# EAGLE design sofi_v7_main (EAGLE 9.1.0)

## Sheet 1 of 2
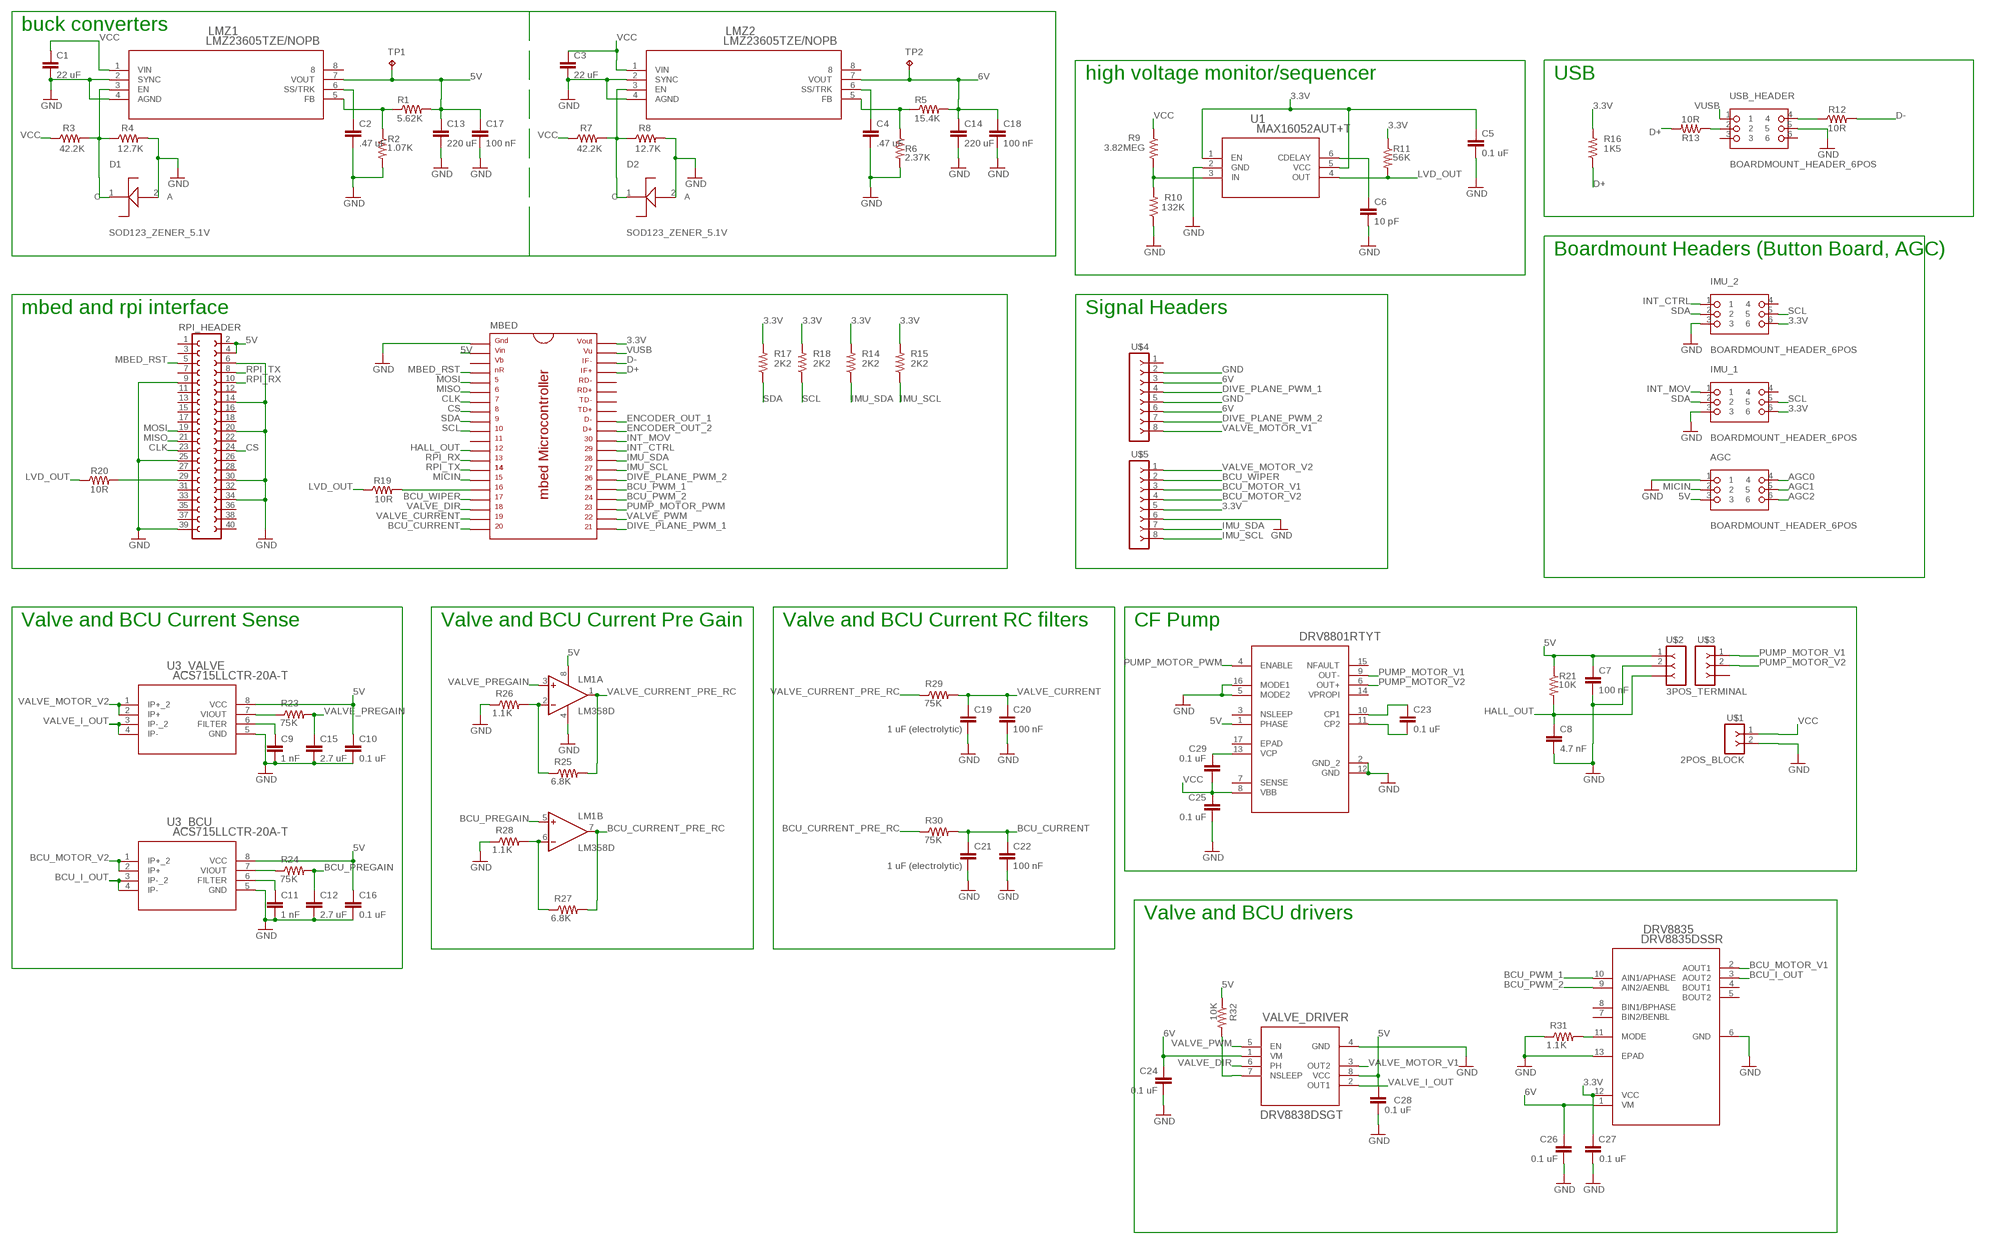
[diagram p0: schematic, sheet 1]

### Parts
AGC  BOARDMOUNT_HEADER_6POS  [BOARDMOUNT_HEADER]
C1  22 uF  C-EUC0805  [C0805]
C2  .47 uF  C-EUC0805  [C0805]
C3  22 uF  C-EUC0805  [C0805]
C4  .47 uF  C-EUC0805  [C0805]
C5  0.1 uF  C-EUC0805  [C0805]
C6  10 pF  C-EUC0603  [C0603]
C7  100 nF  C-EUC0805  [C0805]
C8  4.7 nF  C-EUC0805  [C0805]
C9  1 nF  C-EUC0603  [C0603]
C10  0.1 uF  C-EUC0603  [C0603]
C11  1 nF  C-EUC0603  [C0603]
C12  2.7 uF  C-EUC0603  [C0603]
C13  220 uF  C-EUC1206  [C1206]
C14  220 uF  C-EUC1206  [C1206]
C15  2.7 uF  C-EUC0603  [C0603]
C16  0.1 uF  C-EUC0603  [C0603]
C17  100 nF  C-EUC0805  [C0805]
C18  100 nF  C-EUC0805  [C0805]
C19  1 uF (electrolytic)  C-EUC0603  [C0603]
C20  100 nF  C-EUC0805  [C0805]
C21  1 uF (electrolytic)  C-EUC0603  [C0603]
C22  100 nF  C-EUC0805  [C0805]
C23  0.1 uF  C-EUC0805  [C0805]
C24  0.1 uF  C-EUC0603  [C0603]
C25  0.1 uF  C-EUC0603  [C0603]
C26  0.1 uF  C-EUC0603  [C0603]
C27  0.1 uF  C-EUC0603  [C0603]
C28  0.1 uF  C-EUC0603  [C0603]
C29  0.1 uF  C-EUC0805  [C0805]
D1  SOD123_ZENER_5.1V  [SOD123_ZENER]
D2  SOD123_ZENER_5.1V  [SOD123_ZENER]
DRV8801  DRV8801RTYT  [RTY16]
DRV8835  DRV8835DSSR  [DSS12_P9X2]
IMU_1  BOARDMOUNT_HEADER_6POS  [BOARDMOUNT_HEADER]
IMU_2  BOARDMOUNT_HEADER_6POS  [BOARDMOUNT_HEADER]
LM1  LM358D  [SO08]
LMZ1  LMZ23605TZE/NOPB  [TZA07A]
LMZ2  LMZ23605TZE/NOPB  [TZA07A]
MBED  MBED_MICROCONTROLLER  [DIL40_0.9]
R1  5.62K  R-US_M0805  [M0805]
R2  1.07K  R-US_M0805  [M0805]
R3  42.2K  R-US_M0805  [M0805]
R4  12.7K  R-US_M0805  [M0805]
R5  15.4K  R-US_M0805  [M0805]
R6  2.37K  R-US_M0805  [M0805]
R7  42.2K  R-US_M0805  [M0805]
R8  12.7K  R-US_M0805  [M0805]
R9  3.82MEG  RESISTOR0603  [0603]
R10  132K  RESISTOR0603  [0603]
R11  56K  R-US_R0603  [R0603]
R12  10R  RESISTOR0603  [0603]
R13  10R  RESISTOR0603  [0603]
R14  2K2  RESISTOR0603  [0603]
R15  2K2  RESISTOR0603  [0603]
R16  1K5  RESISTOR0603  [0603]
R17  2K2  RESISTOR0603  [0603]
R18  2K2  RESISTOR0603  [0603]
R19  10R  RESISTOR0603  [0603]
R20  10R  RESISTOR0603  [0603]
R21  10K  R-US_M0805  [M0805]
R23  75K  R-US_M0805  [M0805]
R24  75K  R-US_M0805  [M0805]
R25  6.8K  R-US_M0805  [M0805]
R26  1.1K  R-US_M0805  [M0805]
R27  6.8K  R-US_M0805  [M0805]
R28  1.1K  R-US_M0805  [M0805]
R29  75K  R-US_M0805  [M0805]
R30  75K  R-US_M0805  [M0805]
R31  1.1K  R-US_M0805  [M0805]
R32  10K  R-US_M0805  [M0805]
RPI_HEADER  FE20-2  [FE20-2]
TP1  TPB1,27  [B1,27]
TP2  TPB1,27  [B1,27]
U1  MAX16052AUT+T  [21-0058I]
U3_BCU  ACS715LLCTR-20A-T  [SOIC-8]
U3_VALVE  ACS715LLCTR-20A-T  [SOIC-8]
U$1  2POS_BLOCK  [2POS_BLOCK]
U$2  3POS_TERMINAL  [3POS_TERMINAL]
U$3  3POS_TERMINAL  [3POS_TERMINAL]
U$4  8POS_TERMINAL  [8POS_TERMINAL]
U$5  8POS_TERMINAL  [8POS_TERMINAL]
USB_HEADER  BOARDMOUNT_HEADER_6POS  [BOARDMOUNT_HEADER]
VALVE_DRIVER  DRV8838DSGT  [DSG8_P9X1P6]

### Nets
3.3V: C5.1 C27.1 DRV8835.12(VCC) IMU_1.6 IMU_2.6 MBED.40 R11.1 R14.2 R15.2 R16.2 R17.2 R18.2 U1.1(EN) U1.5(VCC) U$5.5
5V: AGC.3 C7.1 C10.1 C13.1 C16.1 C17.1 C28.1 DRV8801.1(PHASE) LM1.8(P:V+) LMZ1.7(VOUT) MBED.2 R1.2 R21.1 R32.1 RPI_HEADER.2 RPI_HEADER.4 TP1.TP U3_BCU.8(VCC) U3_VALVE.8(VCC) U$2.1 VALVE_DRIVER.8(VCC)
6V: C14.1 C18.1 C24.1 C26.1 DRV8835.1(VM) LMZ2.7(VOUT) R5.2 TP2.TP U$4.3 U$4.6 VALVE_DRIVER.1(VM)
AGC0: AGC.4
AGC1: AGC.5
AGC2: AGC.6
BCU_CURRENT: C21.1 C22.1 MBED.20 R30.2
BCU_CURRENT_PRE_RC: LM1.7(B:OUT) R27.2 R30.1
BCU_I_OUT: DRV8835.3(AOUT2) U3_BCU.3(IP-_2) U3_BCU.4(IP-)
BCU_MOTOR_V1: DRV8835.2(AOUT1) U$5.3
BCU_MOTOR_V2: U3_BCU.1(IP+_2) U3_BCU.2(IP+) U$5.4
BCU_PREGAIN: C12.1 LM1.5(B:+IN) R24.2
BCU_PWM_1: DRV8835.10(AIN1/APHASE) MBED.25
BCU_PWM_2: DRV8835.9(AIN2/AENBL) MBED.24
BCU_WIPER: MBED.17 U$5.2
CLK: MBED.7 RPI_HEADER.23
CS: MBED.8 RPI_HEADER.24
D+: MBED.37 R13.2 R16.1
D-: MBED.38 R12.2
DIVE_PLANE_PWM_1: MBED.21 U$4.4
DIVE_PLANE_PWM_2: MBED.26 U$4.7
ENCODER_OUT_1: MBED.32
ENCODER_OUT_2: MBED.31
GND: AGC.1 C1.2 C2.2 C3.2 C4.2 C5.2 C6.2 C7.2 C8.2 C9.2 C10.2 C11.2 C12.2 C13.2 C14.2 C15.2 C16.2 C17.2 C18.2 C19.2 C20.2 C21.2 C22.2 C24.2 C25.2 C26.2 C27.2 C28.2 D1.2(A) D2.2(A) DRV8801.2(GND_2) DRV8801.5(MODE2) DRV8801.12(GND) DRV8801.16(MODE1) DRV8835.6(GND) DRV8835.13(EPAD) IMU_1.3 IMU_2.3 LM1.4(P:V-) LMZ1.2(SYNC) LMZ1.4(AGND) LMZ2.2(SYNC) LMZ2.4(AGND) MBED.1 R2.2 R4.2 R6.2 R8.2 R10.1 R26.1 R28.1 R31.1 RPI_HEADER.6 RPI_HEADER.9 RPI_HEADER.14 RPI_HEADER.20 RPI_HEADER.25 RPI_HEADER.30 RPI_HEADER.34 RPI_HEADER.39 U1.2(GND) U3_BCU.5(GND) U3_VALVE.5(GND) U$1.2 U$2.2 U$4.2 U$4.5 U$5.6 USB_HEADER.5 VALVE_DRIVER.4(GND)
HALL_OUT: C8.1 MBED.12 R21.2 U$2.3
IMU_SCL: MBED.27 R15.1 U$5.8
IMU_SDA: MBED.28 R14.1 U$5.7
INT_CTRL: IMU_2.1 MBED.29
INT_MOV: IMU_1.1 MBED.30
LVD_OUT: R11.2 R19.1 R20.1 U1.4(OUT)
MBED_RST: MBED.4 RPI_HEADER.5
MICIN: AGC.2 MBED.15
MISO: MBED.6 RPI_HEADER.21
MOSI: MBED.5 RPI_HEADER.19
N$1: R20.2 RPI_HEADER.29
N$2: C23.1 DRV8801.10(CP1)
N$6: LMZ1.5(FB) R1.1 R2.1
N$7: R9.2 R10.2 U1.3(IN)
N$8: D1.1(C) LMZ1.3(EN) R3.2 R4.1
N$9: C4.1 LMZ2.6(SS/TRK)
N$10: LMZ2.5(FB) R5.1 R6.1
N$11: C2.1 LMZ1.6(SS/TRK)
N$12: C6.1 U1.6(CDELAY)
N$13: D2.1(C) LMZ2.3(EN) R7.2 R8.1
N$16: R23.1 U3_VALVE.7(VIOUT)
N$18: C9.1 U3_VALVE.6(FILTER)
N$19: MBED.16 R19.2
N$20: R24.1 U3_BCU.7(VIOUT)
N$21: C11.1 U3_BCU.6(FILTER)
N$22: C23.2 DRV8801.11(CP2)
N$23: C29.1 DRV8801.13(VCP)
N$25: LM1.2(A:-IN) R25.1 R26.2
N$26: R12.1 USB_HEADER.4
N$27: LM1.6(B:-IN) R27.1 R28.2
N$28: R13.1 USB_HEADER.2
N$34: DRV8835.11(MODE) R31.2
N$42: R32.2 VALVE_DRIVER.7(NSLEEP)
PUMP_MOTOR_PWM: DRV8801.4(ENABLE) MBED.23
PUMP_MOTOR_V1: DRV8801.9(OUT-) U$3.1
PUMP_MOTOR_V2: DRV8801.6(OUT+) U$3.2
RPI_RX: MBED.13 RPI_HEADER.10
RPI_TX: MBED.14 RPI_HEADER.8
SCL: IMU_1.5 IMU_2.5 MBED.10 R18.1
SDA: IMU_1.2 IMU_2.2 MBED.9 R17.1
VALVE_CURRENT: C19.1 C20.1 MBED.19 R29.2
VALVE_CURRENT_PRE_RC: LM1.1(A:OUT) R25.2 R29.1
VALVE_DIR: MBED.18 VALVE_DRIVER.6(PH)
VALVE_I_OUT: U3_VALVE.3(IP-_2) U3_VALVE.4(IP-) VALVE_DRIVER.2(OUT1)
VALVE_MOTOR_V1: U$4.8 VALVE_DRIVER.3(OUT2)
VALVE_MOTOR_V2: U3_VALVE.1(IP+_2) U3_VALVE.2(IP+) U$5.1
VALVE_PREGAIN: C15.1 LM1.3(A:+IN) R23.2
VALVE_PWM: MBED.22 VALVE_DRIVER.5(EN)
VCC: C1.1 C3.1 C25.1 C29.2 DRV8801.8(VBB) LMZ1.1(VIN) LMZ2.1(VIN) R3.1 R7.1 R9.1 U$1.1
VUSB: MBED.39 USB_HEADER.1
Unconnected: DRV8801.3(NSLEEP) DRV8801.14(VPROPI) DRV8801.15(NFAULT) DRV8801.17(EPAD) DRV8835.4(BOUT1) DRV8835.5(BOUT2) DRV8835.7(BIN2/BENBL) DRV8835.8(BIN1/BPHASE) IMU_1.4 IMU_2.4 LMZ1.8 LMZ2.8 MBED.3 MBED.11 MBED.33 MBED.34 MBED.35 MBED.36 RPI_HEADER.1 RPI_HEADER.3 RPI_HEADER.7 RPI_HEADER.11 RPI_HEADER.12 RPI_HEADER.13 RPI_HEADER.15 RPI_HEADER.16 RPI_HEADER.17 RPI_HEADER.18 RPI_HEADER.22 RPI_HEADER.26 RPI_HEADER.27 RPI_HEADER.28 RPI_HEADER.31 RPI_HEADER.32 RPI_HEADER.33 RPI_HEADER.35 RPI_HEADER.36 RPI_HEADER.37 RPI_HEADER.38 RPI_HEADER.40 U$3.3 U$4.1 USB_HEADER.3 USB_HEADER.6

### Notes on the sheet
- buck converters
- high voltage monitor/sequencer | USB
- Boardmount Headers (Button Board, AGC)
- mbed and rpi interface | Signal Headers
- Valve and BCU Current Sense | Valve and BCU Current Pre Gain | Valve and BCU Current RC filters | CF Pump
- Valve and BCU drivers

## Sheet 2 of 2

## Power pins joined to a net without a drawn wire
SENSE: DRV8801.7(SENSE)

## Library data of the parts
AGC IMU_1 IMU_2 USB_HEADER = 6pos connector:BOARDMOUNT_HEADER_6POS
C1-C12 C15-C29 = rcl:C-EU: CAPACITOR, European symbol; SPICEPREFIX: C
C13 C14 = resistor:C-EU: CAPACITOR, European symbol
D1 D2 = SOD123_ZENER_DIODE:SOD123_ZENER_5.1V
DRV8801 = DRV8801_ultra_librarian:DRV8801RTYT; MANUFACTURER_PART_NUMBER: DRV8801RTYT; VENDOR: Texas Instruments
DRV8835 = DRV8835_ultra_librarian:DRV8835DSSR; MANUFACTURER_PART_NUMBER: DRV8835DSSR; VENDOR: Texas Instruments
LM1 = linear:LM358: OP AMP also LM158; LM258; LM2904 Source: http://cache.national.com/ds/LM/LM158.pdf
LMZ1 LMZ2 = fish_lmz2_ti:LMZ23605TZE/NOPB; MANUFACTURER_PART_NUMBER: LMZ23605TZENOPB; VENDOR: Texas Instruments
MBED = mbed-microcontroller:MBED_MICROCONTROLLER: mbed Microcontroller, DIP40, 0.9"
R1-R8 R11 R21 R23-R32 = rcl:R-US_: RESISTOR, American symbol; SPICEPREFIX: R
R9 R10 R12-R20 = SparkFun-Resistors:RESISTOR: Generic Resistor Package
RPI_HEADER = con-lsta:FE20-2: FEMALE HEADER; OC_FARNELL: unknown; OC_NEWARK: unknown
TP1 TP2 = testpad:TP: Test pad
U1 = max:MAX16052AUT+T; MANUFACTURER_PART_NUMBER: max16052aut+t; VENDOR: Maxim Integrated Products
U3_BCU U3_VALVE = acs715:ACS715LLCTR-20A-T; MANUFACTURER_PART_NUMBER: ACS715LLCTR20AT; VENDOR: Allegro Microsystems Inc.
U$1 = 2pos_block_terminal:2POS_BLOCK
U$2 U$3 = 3pos_block_terminal:3POS_TERMINAL
U$4 U$5 = 8pos_block_terminal:8POS_TERMINAL
VALVE_DRIVER = DRV8838:DRV8838DSGT; MANUFACTURER_PART_NUMBER: DRV8838DSGT; VENDOR: Texas Instruments

## Board
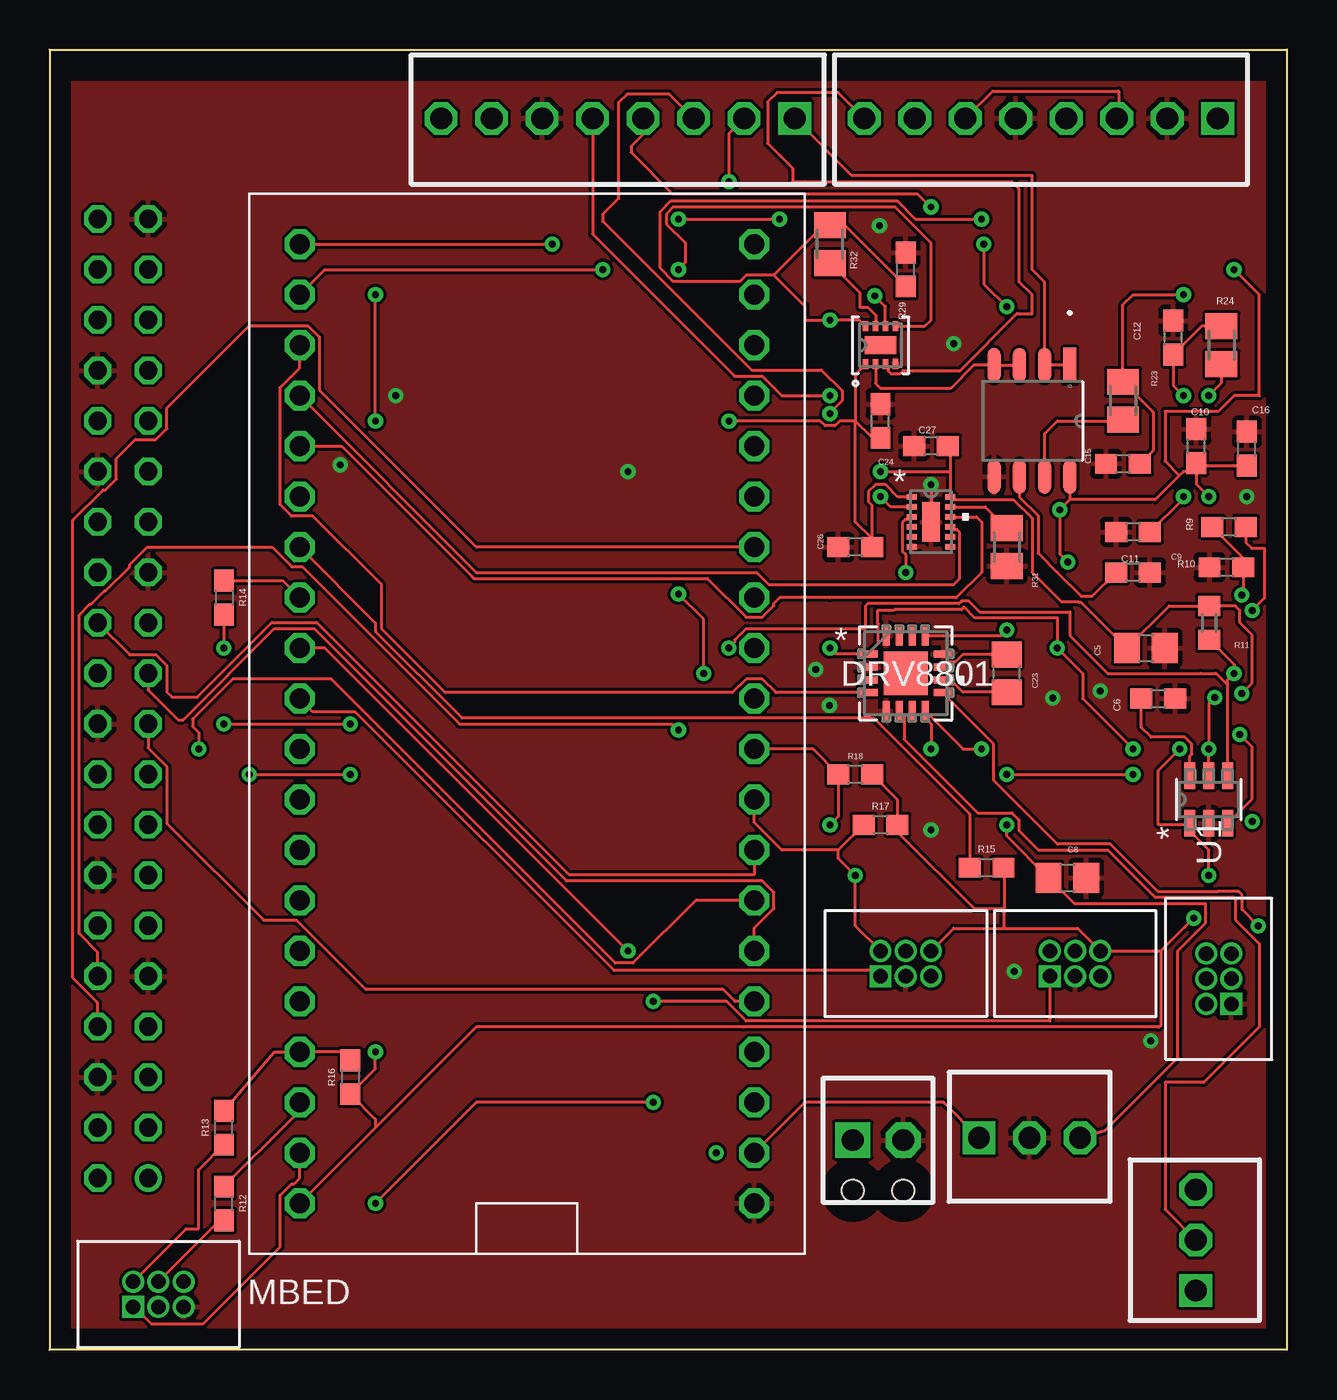
[diagram p1: board, top side]
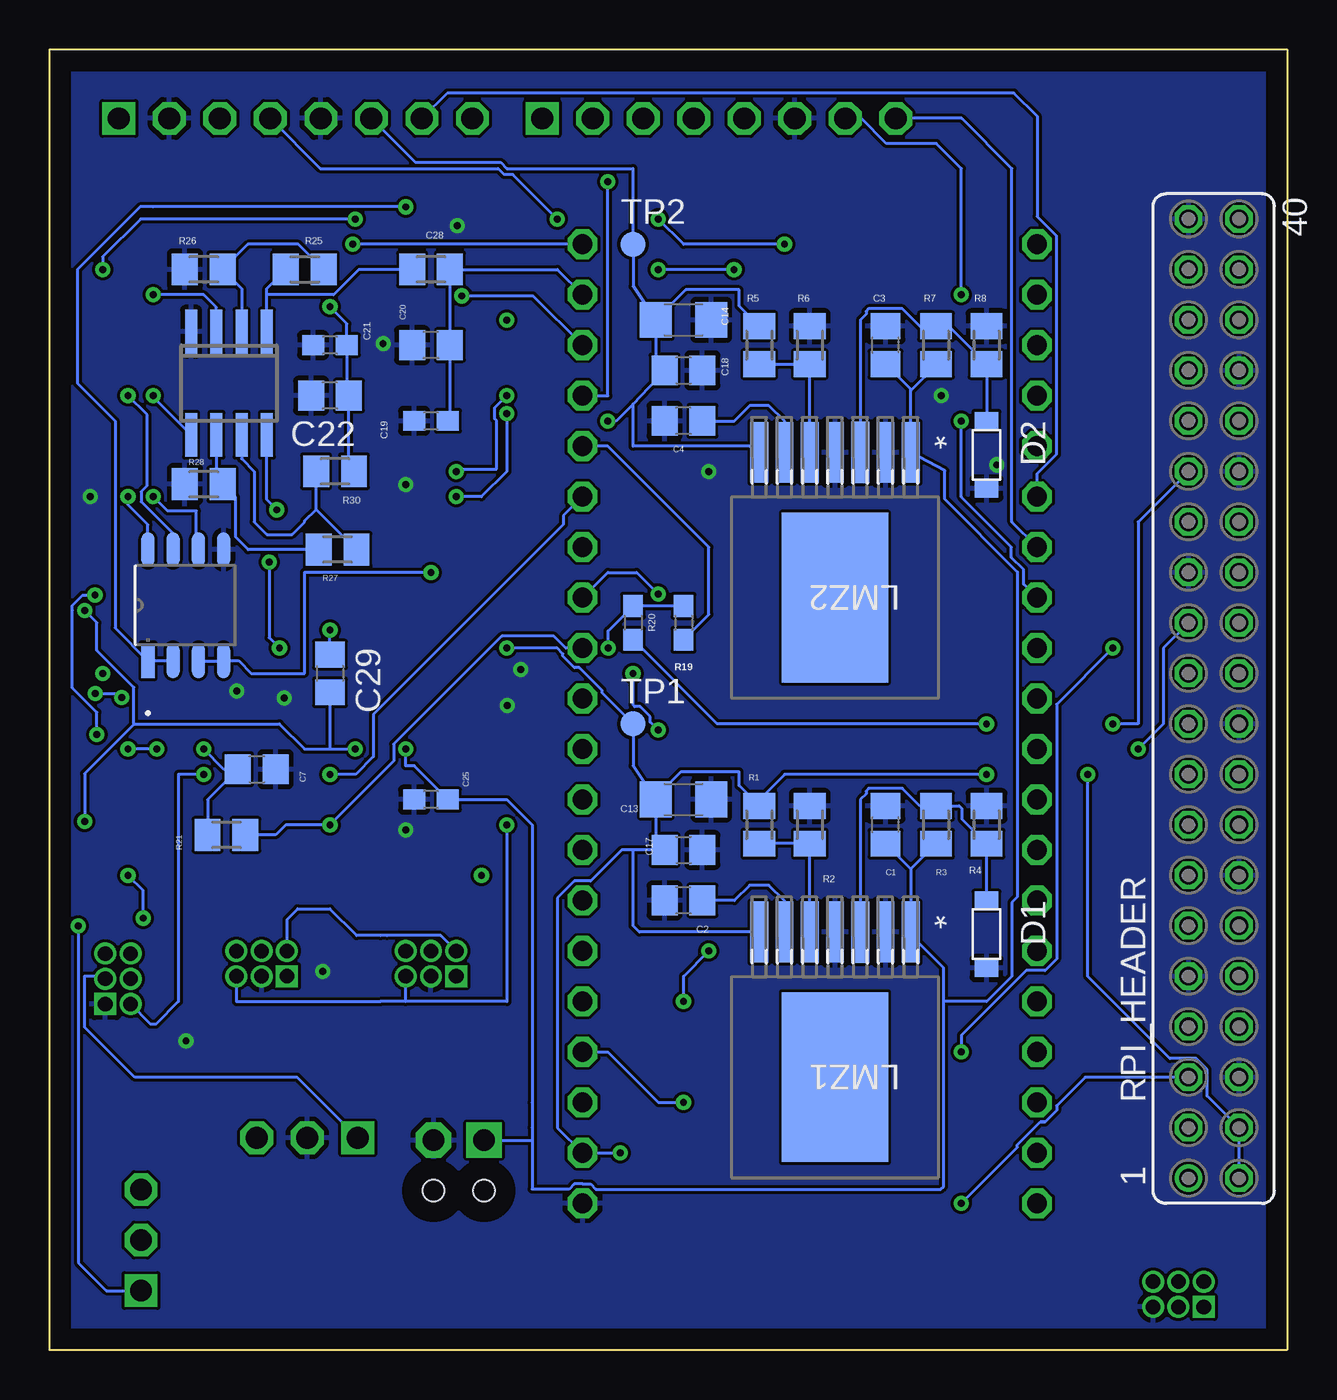
[diagram p2: board, bottom side, seen from below]

Size 62.23 x 65.41 mm. Coordinates in mm from the lower left corner, seen from the top.
Outline: 0,65.41 62.23,65.41 62.23,0 0,0 0,65.41
Copper layers (1*16): Top 0.035mm / dielectric 1.5mm / Bottom 0.035mm
Design rules "default *": minimum track width 6mil, minimum drill 0.35mm, track to track 6mil, track to pad 6mil, pad to pad 5mil, via to via 6mil, smd to smd 6mil, copper to edge 40mil, drill to drill 6mil, minimum pad ring 2mil, minimum via ring 8mil, stop-mask expansion 4mil, vias tented up to drill 0mil, thermal gap 10mil

### Footprints (pad centres in the part's own frame; a part is rotated, then mirrored left to right if it is on the bottom)
BOARDMOUNT_HEADER = drill 0.737 pad 0.813 square: 1 -1.27,-1.27 | drill 0.737 pad 1.016: 2 -1.27,0; 3 0,-1.27; 4 0,0; 5 1.27,-1.27; 6 1.27,0
C0805 = smd 1.3 x 1.5: 1 -0.95,0; 2 0.95,0
C0603 = smd 1.1 x 1: 1 -0.85,0; 2 0.85,0
C1206 = smd 1.6 x 1.8: 1 -1.4,0; 2 1.4,0
SOD123_ZENER = smd 0.9 x 1.2: 1 0,0; 2 3.4,0
RTY16 = smd 1 x 0.35: 1 -1.9,0.975; 2 -1.9,0.325; 3 -1.9,-0.325; 4 -1.9,-0.975; 9 1.9,-0.975; 10 1.9,-0.325; 11 1.9,0.325; 12 1.9,0.975 | smd 0.35 x 1: 5 -0.975,-1.9; 6 -0.325,-1.9; 7 0.325,-1.9; 8 0.975,-1.9; 13 0.975,1.9; 14 0.325,1.9; 15 -0.325,1.9; 16 -0.975,1.9 | smd 2.2 x 2.2: 17 0,0
DSS12_P9X2 = smd 0.5 x 0.28: 1 -0.959,1.25; 2 -0.959,0.75; 3 -0.959,0.25; 4 -0.959,-0.25; 5 -0.959,-0.75; 6 -0.959,-1.25; 7 0.959,-1.25; 8 0.959,-0.75; 9 0.959,-0.25; 10 0.959,0.25; 11 0.959,0.75; 12 0.959,1.25 | smd 0.9 x 2: 13 0,0
SO08 = smd 0.6 x 2.2: 1 -1.905,-2.6; 2 -0.635,-2.6; 3 0.635,-2.6; 4 1.905,-2.6; 5 1.905,2.6; 6 0.635,2.6; 7 -0.635,2.6; 8 -1.905,2.6
TZA07A = smd 0.89 x 3.06: 1 -3.81,-7.305; 2 -2.54,-7.305; 4 0,-7.305; 5 1.27,-7.305; 6 2.54,-7.305; 7 3.81,-7.305 | smd 0.89 x 3.09: 3 -1.27,-7.305 | smd 5.35 x 8.54: 8 0,0
DIL40_0.9 = drill 1 pad 1.397 octagon: 1 -22.86,-11.43; 2 -20.32,-11.43; 3 -17.78,-11.43; 4 -15.24,-11.43; 5 -12.7,-11.43; 6 -10.16,-11.43; 7 -7.62,-11.43; 8 -5.08,-11.43; 9 -2.54,-11.43; 10 0,-11.43; 11 2.54,-11.43; 12 5.08,-11.43; 13 7.62,-11.43; 14 10.16,-11.43; 15 12.7,-11.43; 16 15.24,-11.43; 17 17.78,-11.43; 18 20.32,-11.43; 19 22.86,-11.43; 20 25.4,-11.43; 21 25.4,11.43; 22 22.86,11.43; 23 20.32,11.43; 24 17.78,11.43; 25 15.24,11.43; 26 12.7,11.43; 27 10.16,11.43; 28 7.62,11.43; 29 5.08,11.43; 30 2.54,11.43; 31 0,11.43; 32 -2.54,11.43; 33 -5.08,11.43; 34 -7.62,11.43; 35 -10.16,11.43; 36 -12.7,11.43; 37 -15.24,11.43; 38 -17.78,11.43; 39 -20.32,11.43; 40 -22.86,11.43
M0805 = smd 1.3 x 1.6: 1 -0.95,0; 2 0.95,0
0603 = smd 1.1 x 1: 1 -0.85,0; 2 0.85,0
R0603 = smd 1 x 1.1: 1 -0.85,0; 2 0.85,0
FE20-2 = drill 0.914: 1 -24.13,1.27 | drill 0.914 octagon: 2 -24.13,-1.27; 3 -21.59,1.27; 4 -21.59,-1.27; 5 -19.05,1.27; 6 -19.05,-1.27; 7 -16.51,1.27; 8 -16.51,-1.27; 9 -13.97,1.27; 10 -13.97,-1.27; 11 -11.43,1.27; 12 -11.43,-1.27; 13 -8.89,1.27; 14 -8.89,-1.27; 15 -6.35,1.27; 16 -6.35,-1.27; 17 -3.81,1.27; 18 -3.81,-1.27; 19 -1.27,1.27; 20 -1.27,-1.27; 21 1.27,1.27; 22 1.27,-1.27; 23 3.81,1.27; 24 3.81,-1.27; 25 6.35,1.27; 26 6.35,-1.27; 27 8.89,1.27; 28 8.89,-1.27; 29 11.43,1.27; 30 11.43,-1.27; 31 13.97,1.27; 32 13.97,-1.27; 33 16.51,1.27; 34 16.51,-1.27; 35 19.05,1.27; 36 19.05,-1.27; 37 21.59,1.27; 38 21.59,-1.27; 39 24.13,1.27; 40 24.13,-1.27
B1,27 = smd 1.27 x 1.27: TP 0,0
21-0058I = smd 1.321 x 0.559: 1 -1.194,0.95; 2 -1.194,0; 3 -1.194,-0.95; 4 1.194,-0.95; 5 1.194,0; 6 1.194,0.95
SOIC-8 = smd 1.753 x 0.66: 1 -2.8,1.905; 2 -2.8,0.635; 3 -2.8,-0.635; 4 -2.8,-1.905; 5 2.8,-1.905; 6 2.8,-0.635; 7 2.8,0.635; 8 2.8,1.905
2POS_BLOCK = drill 1.1 pad 1.778 square: 1 -1.27,1.27 | drill 1.1 pad 1.778 octagon: 2 1.27,1.27 | hole 1.1: -1.27,-1.27; 1.27,-1.27
3POS_TERMINAL = drill 1.1 pad 1.3 square: 1 -1.27,0 | drill 1.1 pad 1.3 octagon: 2 1.27,0; 3 3.81,0
8POS_TERMINAL = drill 1.1 pad 1.3 square: 1 -8.89,0 | drill 1.1 pad 1.3 octagon: 2 -6.35,0; 3 -3.81,0; 4 -1.27,0; 5 1.27,0; 6 3.81,0; 7 6.35,0; 8 8.89,0
DSG8_P9X1P6 = smd 0.5 x 0.28: 1 -0.95,0.75; 2 -0.95,0.25; 3 -0.95,-0.25; 4 -0.95,-0.75; 5 0.95,-0.75; 6 0.95,-0.25; 7 0.95,0.25; 8 0.95,0.75 | smd 0.889 x 1.6: 9 0,0

### Placement (x,y rotation side)
AGC  58.17,18.67 90 top
C1  20.2,26.42 90 bottom
C2  30.36,22.61 180 bottom
C3  20.2,50.55 90 bottom
C4  30.36,46.74 180 bottom
C5  55.13,35.31 0 top
C6  55.75,32.77 0 top
C7  51.82,29.21 0 bottom
C8  51.18,23.75 0 top
C9  54.48,39.12 0 top
C10  57.67,45.47 90 top
C11  54.48,41.15 180 top
C12  56.52,50.93 90 top
C13  30.36,27.69 0 bottom
C14  30.36,51.82 0 bottom
C15  53.98,44.58 180 top
C16  60.21,45.34 90 top
C17  30.36,25.15 0 bottom
C18  30.36,49.28 0 bottom
C19  43.05,46.74 180 bottom
C20  43.05,50.55 180 bottom
C21  48.13,50.55 180 bottom
C22  48.13,48.01 180 bottom
C23  48.13,34.04 90 top
C24  41.78,46.74 90 top
C25  43.05,27.69 180 bottom
C26  40.51,40.39 180 top
C27  44.32,45.47 180 top
C28  43.05,54.36 90 top
C29  48.13,34.04 270 bottom
D1  15.12,22.61 270 bottom
D2  15.12,46.74 270 bottom
DRV8801  43.05,34.04 0 top
DRV8835  44.32,41.66 0 top
IMU_1  43.05,20.07 0 top
IMU_2  51.57,20.07 0 top
LM1  53.21,48.63 180 bottom
LMZ1  22.73,13.72 180 bottom
LMZ2  22.73,37.85 180 bottom
MBED  24,30.23 90 top
R1  26.55,26.42 90 bottom
R2  24,26.42 90 bottom
R3  17.66,26.42 90 bottom
R4  15.12,26.42 90 bottom
R5  26.55,50.55 90 bottom
R6  24,50.55 90 bottom
R7  17.66,50.55 90 bottom
R8  15.12,50.55 90 bottom
R9  59.31,41.4 180 top
R10  59.18,39.37 0 top
R11  58.31,36.58 270 top
R12  8.77,7.37 90 top
R13  8.77,11.18 90 top
R14  8.77,37.85 270 top
R15  47.12,24.26 0 top
R16  15.12,13.72 270 top
R17  41.78,26.42 0 top
R18  40.51,28.96 0 top
R19  30.36,36.58 270 bottom
R20  32.89,36.58 270 bottom
R21  53.34,25.91 0 bottom
R23  53.98,47.75 90 top
R24  58.93,50.55 90 top
R25  49.4,54.36 180 bottom
R26  54.48,54.36 0 bottom
R27  47.75,40.26 0 bottom
R28  54.48,43.55 0 bottom
R29  43.05,54.36 0 bottom
R30  47.88,44.2 0 bottom
R31  48.13,40.39 90 top
R32  39.24,55.63 270 top
RPI_HEADER  3.69,32.77 90 bottom
TP1  32.89,31.5 0 bottom
TP2  32.89,55.63 0 bottom
U1  58.29,27.69 90 top
U3_BCU  55.38,37.47 90 bottom
U3_VALVE  49.4,46.74 270 top
U$1  41.66,9.28 0 top
U$2  48.01,10.67 0 top
U$3  57.64,4.25 90 top
U$4  49.86,61.95 180 top
U$5  28.57,61.95 180 top
USB_HEADER  5.46,3.43 0 top
VALVE_DRIVER  41.78,50.55 90 top

### Tracks (layer width: path | path; a pad name or v marks a point on that pad's centre or on a via)
3.3V  (via drill 0.35)
  Top 0.152: C27.1 45.28,45.36 45.28,44.2 | 45.28,44.2 45.28,42.93 | 45.28,42.93 DRV8835.12 | v39.24,48.01 36.82,48.01 35.84,48.99 34.45,48.99 27.3,56.14 U$5.5 | v41.78,44.2 45.28,44.2 | 16.39,11.18 21.46,16.26 34.88,16.26 34.9,16.24 55.71,16.24 55.75,16.24 55.8,16.24 55.88,16.32 55.88,20.07 | 16.39,11.18 MBED.40 | 16.39,11.18 16.39,11.6 R16.2 16.39,14.14 v16.39,14.99 | 45.28,42.93 45.43,42.78 48.47,42.78 49.4,41.84 49.4,39.12 50.67,37.85 50.9,37.62 51.74,37.62 51.75,37.61 51.88,37.61 C5.1 56.3,37.43 R11.1 59.63,37.43 59.85,37.21 59.85,36.58 60.48,35.96 60.48,33.55 v59.95,33.02 | R14.2 v8.77,35.31 | R15.2 48.01,24.22 48.01,22.19 | R18.2 42.63,27.69 R17.2 42.63,26.06 46.51,22.19 48.01,22.19 | IMU_1.6 45.47,21.21 48.01,21.21 | 48.01,21.21 48.01,22.19 | 48.01,21.21 51.7,21.21 IMU_2.6 55.88,20.07 | v57.53,21.72 57.09,21.27 55.88,20.07 | v56.84,30.23 55.75,29.14 55.75,26.42 57.27,26.42 U1.1 57.34,26.1 58.29,25.15 v58.29,23.88 | U1.5 v58.29,30.23 58.29,31.58 58.29,32.52 v58.6,32.83
  Bottom 0.152: v8.77,35.31 11.59,32.48 11.59,19.66 12.17,19.08 13.13,19.08 16.39,15.82 v16.39,14.99 | v41.78,44.2 41.66,44.32 39.75,44.32 39.75,46.75 39.85,46.85 39.85,47.4 v39.24,48.01 | v57.53,21.72 57.53,23.11 v58.29,23.88 | v56.84,30.23 v58.29,30.23 | v59.95,33.02 58.79,33.02 v58.6,32.83
5V  (via drill 0.35)
  Top 0.152: v10.04,28.96 v15.12,28.96 | v39.24,35.31 39.54,35.01 DRV8801.1 41.68,35.53 41.68,36.53 41.66,36.55 41.66,37.21 42.47,37.21 42.5,37.24 45.85,37.24 45.99,37.38 46.54,36.83 50.67,36.83 v50.67,35.31 51.95,34.04 51.95,32.77 v54.48,30.23 | C28.1 39.98,56.58 R32.1 38.92,56.58 36.42,54.07 | VALVE_DRIVER.8 40.71,51.82 v39.24,51.82 37.97,51.82 37.97,52.51 36.42,54.07 | v46.86,56.9 43.54,56.9 42.63,57.81 31.25,57.81 30.71,57.27 30.71,54.41 31.37,53.75 34.71,53.75 35.03,54.07 36.42,54.07 | U3_VALVE.8 51.31,42.93 51.31,42.77 | 51.31,42.77 v50.8,42.26 50.8,40.03 v51.2,39.64 | MBED.2 37.97,12.45 44.96,12.45 U$2.1 | 51.31,42.77 55.6,42.77 56.82,43.99 | 56.82,43.99 57.02,44.2 57.25,44.2 C10.1 | C10.1 57.67,43.55 v58.29,42.93 | C10.1 57.8,44.49 59.56,44.49 C16.1 | v59.56,54.36 60.83,53.09 60.83,48.01 59.56,48.01 58.76,47.21 56.1,47.21 56.1,44.71 56.82,43.99
  Bottom 0.152: C13.1 32.89,29.38 TP1.TP 34.45,33.05 34.45,33.17 35.6,34.32 35.84,34.32 36.42,34.9 36.42,35.02 36.7,35.31 v39.24,35.31 | v15.12,28.96 25.28,28.96 26.71,27.53 R1.2 27.56,28.38 27.56,29.08 30.48,29.08 31.75,27.81 C13.1 | v51.2,39.64 51.2,35.83 v50.67,35.31 | v10.04,28.96 10.04,18.8 5.89,14.66 4.57,14.66 4.02,14.11 4.02,12.78 RPI_HEADER.4 RPI_HEADER.2 | v46.86,56.9 57.66,56.9 59.56,54.99 v59.56,54.36 | LM1.8 51.31,42.77 v50.8,42.26 | C17.1 31.37,25.15 | 31.37,25.15 32.89,25.15 | 32.89,25.15 33.47,25.15 35.03,23.59 35.84,23.59 36.7,22.73 36.7,11.18 MBED.2 v33.53,9.91 | C13.1 31.75,25.53 31.37,25.15 | R21.1 54.29,27.69 C7.1 53.47,29.21 v54.48,30.23 | U$2.1 49.79,13.72 57.94,13.72 60.48,16.26 60.48,18.8 59.56,18.8 AGC.3 | U3_BCU.8 57.29,41.52 58.29,42.52 v58.29,42.93 | LMZ1.7 32.58,21.02 32.89,21.34 32.89,25.15
6V  (via drill 0.35)
  Top 0.152: DRV8835.1 42.66,42.91 42.04,43.53 41.53,43.53 41.18,43.18 41.18,42.68 41.36,42.49 C26.1 41.36,40.81 40.51,41.66 40.51,46.74 | 40.51,46.74 39.74,46.74 39.5,46.49 38.99,46.49 38.75,46.74 v34.16,46.74 | 40.51,46.74 40.51,49.08 VALVE_DRIVER.1 | C24.1 41.36,45.89 40.51,46.74 | U$4.6 47.43,63.33 53.76,63.33 53.76,62.04 U$4.3
  Bottom 0.152: LMZ2.7 27.02,45.47 32.89,45.47 32.89,47.59 | 32.89,47.59 C18.1 31.75,49.73 C14.1 | C14.1 32.89,53.51 TP2.TP 32.89,59.44 39.24,59.44 39.55,59.74 43.84,59.74 U$4.6 | 32.89,47.59 33.74,46.74 v34.16,46.74 | R5.2 27.56,52.51 27.56,53.34 30.23,53.34 C14.1
BCU_CURRENT  (via drill 0.35)
  Top 0.152: v46.99,55.63 46.99,53.63 v48.13,52.48
  Bottom 0.152: MBED.20 v46.99,55.63 | R30.2 47.18,44.45 C22.1 47.28,48.11 C21.1 47.28,51.63 v48.13,52.48
BCU_CURRENT_PRE_RC
  Bottom 0.152: R27.2 48.83,42.29 | 48.83,42.29 R30.1 | 48.83,42.29 49.4,41.71 49.4,41.66 50.04,41.02 51.31,41.02 51.95,41.66 51.95,44.2 52.58,44.83 LM1.7
BCU_I_OUT  (via drill 0.35)
  Top 0.152: DRV8835.3 43.23,41.78 43.02,41.78 42.89,41.64 42.89,40.17 43.05,40 v43.05,39.12
  Bottom 0.152: U3_BCU.3 U3_BCU.4 53.24,34.67 52.73,34.67 52.1,34.04 49.4,34.04 49.4,39.12 v43.05,39.12
BCU_MOTOR_V1  (via drill 0.35)
  Top 0.152: DRV8835.2 42.3,42.41 v41.78,42.93 | v39.24,47.1 39.24,47.15 39.85,47.76 39.85,48.26 38.82,49.29 35.3,49.29 27.82,56.78 27.82,57.13 28.62,57.94 28.61,57.96 28.61,62.75 29.04,63.19 31.15,63.19 U$5.3
  Bottom 0.152: v41.78,42.93 40.51,42.93 39.24,44.2 v39.24,47.1
BCU_MOTOR_V2  (via drill 0.35)
  Top 0.152: v44.32,57.5 44.3,57.5 43.63,58.17 31.31,58.17 29.24,60.24 29.24,60.55 29.84,61.16 U$5.4
  Bottom 0.152: U3_BCU.2 U3_BCU.1 58.94,36.32 58.94,46.74 60.83,48.63 60.83,54.36 57.69,57.5 57.02,57.5 v44.32,57.5
BCU_PREGAIN  (via drill 0.35)
  Top 0.152: v57.02,48.01 56.52,48.51 C12.1 57.94,51.5 R24.2
  Bottom 0.152: LM1.5 57.02,47.94 v57.02,48.01
BCU_PWM_1
  Top 0.152: MBED.25 14.68,45.47 21.25,38.9 | 21.25,38.9 21.34,38.81 33.08,38.81 35.03,36.86 35.84,36.86 36.42,37.44 36.42,37.56 36.7,37.85 39.24,37.85 45.59,37.85 46.86,39.12 46.86,41.66 46.61,41.91 DRV8835.10 | 21.25,38.9
BCU_PWM_2
  Top 0.152: MBED.24 21.46,39.12 35.55,39.12 36.16,38.51 45.47,38.51 45.76,38.8 45.76,41.14 45.63,41.28 45.41,41.28 DRV8835.9
BCU_WIPER  (via drill 0.35)
  Top 0.152: U$5.2 34.16,61.19 v34.16,58.77
  Bottom 0.152: MBED.17 34.16,48.01 v34.16,58.77
CLK  (via drill 0.35)
  Top 0.152: v7.5,30.23 7.5,31.07 7.19,31.37 7.19,31.74 9.2,33.75 14.15,33.75 28.44,19.46 29.34,19.46 32.48,22.61 MBED.7
  Bottom 0.152: RPI_HEADER.23 6.22,35.31 6.22,31.5 v7.5,30.23
CS
  Top 0.152: MBED.8 35.43,23.89 26.12,23.89 13.42,36.59 11.18,36.59 7.42,32.84 6.15,32.84 5.89,33.1 5.89,34.43 5.34,34.98 4.02,34.98 RPI_HEADER.24
D+
  Top 0.152: R13.2 11.3,14.99 MBED.37 14.7,14.99 R16.1
D-
  Top 0.152: R12.2 12.15,11.6 12.58,12.03 MBED.38
DIVE_PLANE_PWM_1  (via drill 0.35)
  Top 0.152: MBED.21 v25.28,55.63 | v31.63,56.9 v36.7,56.9
  Bottom 0.152: v25.28,55.63 30.36,55.63 v31.63,56.9 | v36.7,56.9 38.94,59.13 39.37,59.13 39.68,59.44 48.61,59.44 U$4.4
DIVE_PLANE_PWM_2
  Bottom 0.152: MBED.26 12.58,44.08 11.59,45.06 11.59,56.03 12.58,57.02 12.58,62.07 13.74,63.23 42.23,63.23 U$4.7
GND  (via drill 0.35)
  Top 0.152: v44.32,43.54 DRV8835.13
  other vias: 29.09,44.2 17.4,48.01 52.83,33.15 44.32,26.16 48.51,19.05 60.2,42.93 38.53,34.24 39.22,32.41 45.47,50.62 41.73,56.57 14.61,44.53 50.45,32.79 55.38,15.53
  pour Top: -0.38,63.75 -0.38,-0.25 62.1,-0.25 62.1,63.75
  pour Bottom: -0.25,64.39 62.1,64.39 62.1,-0.38 -0.25,-0.38
HALL_OUT  (via drill 0.35)
  Top 0.152: v48.13,26.42 48.13,25.85 C8.1 51.53,22.45 58.14,22.45 58.14,21.97 58.14,21.47 56.74,20.06 56.74,14.7 53.09,11.05 U$2.3
  Bottom 0.152: MBED.12 36.27,35.31 36.88,35.91 39.5,35.91 44.93,30.48 44.93,29.62 v48.13,26.42 50.36,26.42 50.87,25.91 R21.2
IMU_SCL
  Top 0.152: MBED.27 16.39,36.58 16.39,36.15 20.75,31.78 41.28,31.78 41.43,31.78 46.27,26.95 R15.1
  Bottom 0.152: MBED.27 13.85,41.66 13.85,59.44 16.36,61.95 U$5.8
IMU_SDA  (via drill 0.35)
  Top 0.152: v16.39,46.74 v16.39,53.09 | R14.1 11.72,38.7 MBED.28
  Bottom 0.152: v16.39,46.74 16.39,42.91 13.86,40.39 13.86,39.87 13.25,39.26 13.25,39.12 13.25,38.52 MBED.28 | v16.39,53.09 16.39,59.44 17.63,60.69 20.16,60.69 21.42,61.95 U$5.7
INT_CTRL  (via drill 0.35)
  Top 0.152: v30.36,17.53 34.04,17.53 35.03,16.54 50.3,16.54 IMU_2.1 | v29.09,20.07 13.85,35.31 MBED.29
  Bottom 0.152: v30.36,17.53 30.36,18.8 v29.09,20.07
INT_MOV
  Top 0.152: MBED.30 13.24,32.1 15.37,32.1 28.39,19.08 41.78,19.08 IMU_1.1
LVD_OUT  (via drill 0.35)
  Top 0.152: v34.15,35.31 34.45,35.61 34.45,35.71 35.03,36.29 41,36.29 41.05,36.33 41.05,37.44 41.15,37.54 45.72,37.54 45.86,37.68 46.22,37.68 46.77,37.13 51.31,37.13 51.31,35.94 53.21,34.04 57.88,34.04 58.66,34.04 59.24,33.46 | U1.4 59.24,33.46 | 59.24,33.46 59.24,33.72 | 59.24,33.72 v59.56,34.04 59.56,34.48 R11.2 | 59.24,33.72
  Bottom 0.152: R19.1 R20.1 34.15,36.17 v34.15,35.31
MBED_RST  (via drill 0.35)
  Top 0.152: v30.36,12.45 21.46,12.45 v16.39,7.37
  Bottom 0.152: MBED.4 34.16,14.99 31.63,12.45 v30.36,12.45 | v16.39,7.37 13.56,10.19 13.56,10.31 12.41,11.46 | 12.41,11.46 12.17,11.46 | RPI_HEADER.5 10.16,13.72 11.59,12.28 11.59,12.04 12.17,11.46 | 12.17,11.46 12.41,11.46
MICIN  (via drill 0.35)
  Top 0.152: v48.13,28.96 v54.48,28.96
  Bottom 0.152: MBED.15 36.4,41.96 36.4,41.53 45.95,31.98 45.95,29.85 46.85,28.96 v48.13,28.96 | v54.48,28.96 55.75,28.96 55.75,17.53 56.9,16.38 57.15,16.38 AGC.2
MISO
  Top 0.152: MBED.6 35.43,21.22 36.42,22.2 36.42,23.01 35.84,23.59 25.99,23.59 13.29,36.29 11.31,36.29 6.71,31.69 6.45,31.69 4.96,33.19 RPI_HEADER.21
MOSI
  Top 0.152: MBED.5 34.48,17.53 33.87,18.13 15.9,18.13 12.41,21.62 10.75,21.62 5.89,26.48 5.89,29.35 4.96,30.29 RPI_HEADER.19
N$1  (via drill 0.35)
  Top 0.152: v8.77,31.5 v15.12,31.5
  Bottom 0.152: v15.12,31.5 28.66,31.5 R20.2 | RPI_HEADER.29 7.5,41.66 7.5,31.5 v8.77,31.5
N$2
  Top 0.152: DRV8801.10 45.2,33.47 45.55,33.47 45.93,33.09 C23.1
N$6
  Bottom 0.152: LMZ1.5 R2.1 R1.1
N$7  (via drill 0.35)
  Top 0.152: R9.2 60.03,39.83 R10.2 60.03,38.05 v59.95,37.97 | U1.3 60.48,27.73 60.48,30.33 v59.85,30.96
  Bottom 0.152: v59.85,30.96 59.85,32.07 61.09,33.3 61.09,37.21 61.09,37.46 60.58,37.97 v59.95,37.97
N$8
  Bottom 0.152: D1.1 R4.1 16.36,26.71 16.36,27.23 16.5,27.37 R3.2 18.47,27.37 19.35,28.25 21.04,28.25 21.17,28.11 21.17,27.98 21.46,27.69 LMZ1.3
N$9
  Bottom 0.152: C4.1 27.8,46.74 27.03,47.5 26.06,47.5 25.28,46.72 LMZ2.6
N$10
  Bottom 0.152: R5.1 R6.1 LMZ2.5
N$11
  Bottom 0.152: C2.1 27.8,22.61 27.03,23.37 26.06,23.37 25.28,22.59 LMZ1.6
N$12
  Top 0.152: C6.1 54.9,31.32 55.39,30.83 57.09,30.83 57.45,30.48 57.45,29.97 57.34,29.87 U1.6
N$13
  Bottom 0.152: D2.1 R8.1 17.02,51.5 R7.2 18.47,51.5 19.35,52.38 21.04,52.38 21.17,52.24 21.17,52.11 21.46,51.82 LMZ2.3
N$16
  Top 0.152: R23.1 53.91,46.74 50.67,46.74 50.04,46.1 U3_VALVE.7
N$18
  Top 0.152: U3_VALVE.6 48.77,42.91 49.71,41.97 49.71,40.08 50.67,39.12 | 50.67,39.12 51.88,37.91 52.43,37.91 C9.1 | 50.67,39.12
N$19
  Bottom 0.152: MBED.16 34.16,45.47 29.09,40.39 29.09,37 R19.2
N$20  (via drill 0.35)
  Top 0.152: R24.1 58.93,48.64 v58.29,48.01
  Bottom 0.152: v58.29,48.01 57.33,47.04 57.33,43.48 57.63,43.18 57.63,42.68 56.02,41.06 U3_BCU.7
N$21  (via drill 0.35)
  Top 0.152: C11.1 57.02,42.84 v57.02,42.93
  Bottom 0.152: U3_BCU.6 54.85,40.37 54.85,42.21 56.3,42.21 v57.02,42.93
N$22
  Top 0.152: DRV8801.11 45.2,34.61 45.55,34.61 45.93,34.99 C23.2
N$23  (via drill 0.35)
  Top 0.152: DRV8801.13 47.85,35.94 v48.13,36.22
  Bottom 0.152: C29.1 v48.13,36.22
N$25
  Bottom 0.152: LM1.2 52.58,53.4 R26.2 52.26,55.63 49.72,55.63 R25.1
N$26
  Top 0.152: R12.1 8.77,6.48 8.51,6.48 USB_HEADER.4
N$27
  Bottom 0.152: LM1.6 53.85,43.87 R28.2 52.88,42.9 52.88,40.9 52.25,40.26 R27.1
N$28
  Top 0.152: R13.1 7.5,9.06 7.5,6.1 6.86,6.1 USB_HEADER.2
N$34
  Top 0.152: DRV8835.11 47.06,42.41 R31.2
N$42
  Top 0.152: VALVE_DRIVER.7 41.53,52.07 41.15,52.45 40.74,52.45 40.74,53.18 R32.2
PUMP_MOTOR_PWM
  Top 0.152: DRV8801.4 36.53,33.06 35.84,33.75 35.03,33.75 34.34,33.06 19.9,33.06 16.69,36.27 16.69,38.49 13.24,41.94 12.17,41.94 11.59,42.52 11.59,48.41 12.58,49.4 MBED.23
PUMP_MOTOR_V1  (via drill 0.35)
  Top 0.152: DRV8801.9 44.95,32.99 47.47,30.48 47.47,28.65 50.67,25.45 53.34,25.45 55.73,23.06 58.29,23.06 | 58.29,23.06 58.75,23.06 | 58.75,23.06 | 58.29,23.06 | 58.75,23.06 59.79,23.06 59.97,22.88 59.97,22.15 v60.79,21.34
  Bottom 0.152: U$3.1 59.38,2.98 60.79,4.39 v60.79,21.34
PUMP_MOTOR_V2
  Top 0.152: DRV8801.6 42.98,31.89 42.98,30.72 46.67,27.02 48.39,27.02 48.74,26.67 48.74,26.12 49.72,25.15 53.21,25.15 55.61,22.75 59.56,22.75 59.66,22.65 59.66,21.6 60.83,20.43 60.83,16.26 58.03,13.46 56.1,13.46 56.1,7.06 U$3.2
RPI_RX  (via drill 0.35)
  Top 0.152: 8.77,40.39 | v31.63,31.18 31.32,31.48 20.62,31.48 12.7,39.4 12.17,39.4 11.19,40.39 8.77,40.39 | v32.89,34.04 32.89,36.76 v31.63,38.03 | RPI_HEADER.10 2.42,20.01 1.48,20.95 1.48,36.97 2.03,37.52 2.08,37.52 2.74,38.18 2.8,38.18 4.02,39.39 4.02,39.51 4.9,40.39 8.77,40.39
  Bottom 0.152: v32.89,34.04 32.89,32.45 32.81,32.36 32.54,32.36 32.03,31.85 32.03,31.58 v31.63,31.18 | MBED.13 34.16,39.12 32.71,39.12 v31.63,38.03
RPI_TX
  Top 0.152: MBED.14 21.46,40.39 13.85,48.01 | 13.56,48.29 13.85,48.01 | 13.56,48.29 13.85,48.01 | 13.56,48.29 13.56,50.95 12.98,51.53 10.04,51.53 5.89,47.39 5.89,46.35 5.34,45.8 4.3,45.8 3.35,44.85 3.35,43.81 2.8,43.26 2.69,43.26 1.17,41.74 1.17,18.71 2.42,17.47 RPI_HEADER.8
SCL  (via drill 0.35)
  Top 0.152: MBED.10 38.39,30.23 R18.1 39.66,26.84 v39.24,26.42
  Bottom 0.152: 44.32,17.53 IMU_1.5 | IMU_2.5 52.84,17.53 45.59,17.53 44.32,17.53 | v39.24,26.42 39.24,17.53 44.32,17.53
SDA  (via drill 0.35)
  Top 0.152: MBED.9 35.43,26.54 36.82,25.15 39.66,25.15 | R17.1 39.66,25.15 | 39.66,25.15 39.66,24.73 v40.51,23.88 40.51,21.34 IMU_1.2
  Bottom 0.152: IMU_2.2 50.3,21.64 49.76,22.19 48.13,22.19 46.79,20.85 45.59,20.85 45.27,20.85 42.57,20.85 IMU_1.2
VALVE_CURRENT
  Bottom 0.152: MBED.19 36.7,54.36 R29.2 C20.1 42.1,46.84 C19.1
VALVE_CURRENT_PRE_RC
  Bottom 0.152: LM1.1 51.31,53.09 | 51.31,53.09 51.31,53.4 R25.2 | R29.1 46.68,54.36 47.95,53.09 51.31,53.09
VALVE_DIR  (via drill 0.35)
  Top 0.152: VALVE_DRIVER.6 42.03,52.49 v41.5,53.03
  Bottom 0.152: MBED.18 37.91,53.03 v41.5,53.03
VALVE_I_OUT
  Top 0.152: U3_VALVE.3 U3_VALVE.4 46.48,49.54 45.31,48.37 41.78,48.37 41.53,48.62 VALVE_DRIVER.2
VALVE_MOTOR_V1
  Top 0.152: VALVE_DRIVER.3 42.17,49.47 42.17,49.25 42.3,49.12 42.77,49.12 42.93,49.28 45.79,49.28 48.65,52.14 49.38,52.14 49.4,52.12 49.4,53.09 48.74,53.75 48.74,58.42 48.39,58.77 37.97,58.77 37.37,58.77 37.37,59.33 37.37,59.44 36.1,60.71 36.1,62.78 36.58,63.26 39.67,63.26 U$4.8
VALVE_MOTOR_V2
  Top 0.152: U3_VALVE.1 U3_VALVE.2 50.04,53.72 49.4,54.36 49.4,59.08 40.34,59.08 U$5.1
VALVE_PREGAIN  (via drill 0.35)
  Top 0.152: C15.1 55.5,45.25 55.5,47.18 R23.2 53.98,52.58 54.48,53.09 v57.02,53.09
  Bottom 0.152: LM1.3 53.85,52.45 54.48,53.09 v57.02,53.09
VALVE_PWM  (via drill 0.35)
  Top 0.152: MBED.22 13.85,54.36 v27.82,54.36 | v31.63,54.36 31.96,54.69 31.96,55.7 31.02,56.65 31.02,57.15 31.37,57.5 42.5,57.5 44.32,55.68 44.32,51.82 44,51.5 VALVE_DRIVER.5
  Bottom 0.152: v27.82,54.36 v31.63,54.36
VCC  (via drill 0.35)
  Top 0.152: v44.32,30.23 44.32,31.5 44.03,31.79 DRV8801.8 45.94,30.23 v46.86,30.23 | R9.1 60.16,40.62 60.45,40.33 61.09,40.33 61.09,37.82 v60.48,37.21
  Bottom 0.152: 18.93,48.26 18.93,48.33 C3.1 | R3.1 18.93,24.2 | 18.93,24.2 LMZ1.1 18.93,20.87 17.27,19.22 17.27,17.53 | C1.1 18.93,24.2 | 17.27,17.53 17.27,8.21 17.41,8.08 34.76,8.08 35.03,8.35 35.43,8.35 | v44.32,30.23 44.32,29.38 43.89,29.38 C25.1 39.24,27.69 37.97,26.42 37.97,12.45 37.97,11.18 37.97,10.55 | 17.27,17.53 15.12,17.53 13.85,18.8 13.85,22.5 13.56,22.79 13.56,39.14 17.21,42.79 17.21,44.23 LMZ2.1 18.93,48.26 | R7.1 17.66,49.53 18.93,48.26 | U$1.1 37.97,10.55 | 35.44,8.34 35.43,8.35 | 35.43,8.35 | 35.43,8.35 35.44,8.34 | 35.44,8.34 35.84,8.34 36.11,8.08 37.97,8.08 37.97,10.55 | 57.98,31.5 50.67,31.5 49.4,30.23 48.13,30.23 | 48.13,30.23 v46.86,30.23 | 57.98,31.5 60.48,29 v60.48,26.58 | 57.98,31.5 | 57.98,31.5 58,31.51 58,33.33 59.85,35.18 59.85,36.58 v60.48,37.21 | C29.2 48.13,30.23
VUSB
  Top 0.152: MBED.39 12.58,8.64 12.29,8.35 12.17,8.35 11.59,7.77 11.59,5.18 7.72,1.31 5.11,1.31 4.26,2.16 USB_HEADER.1